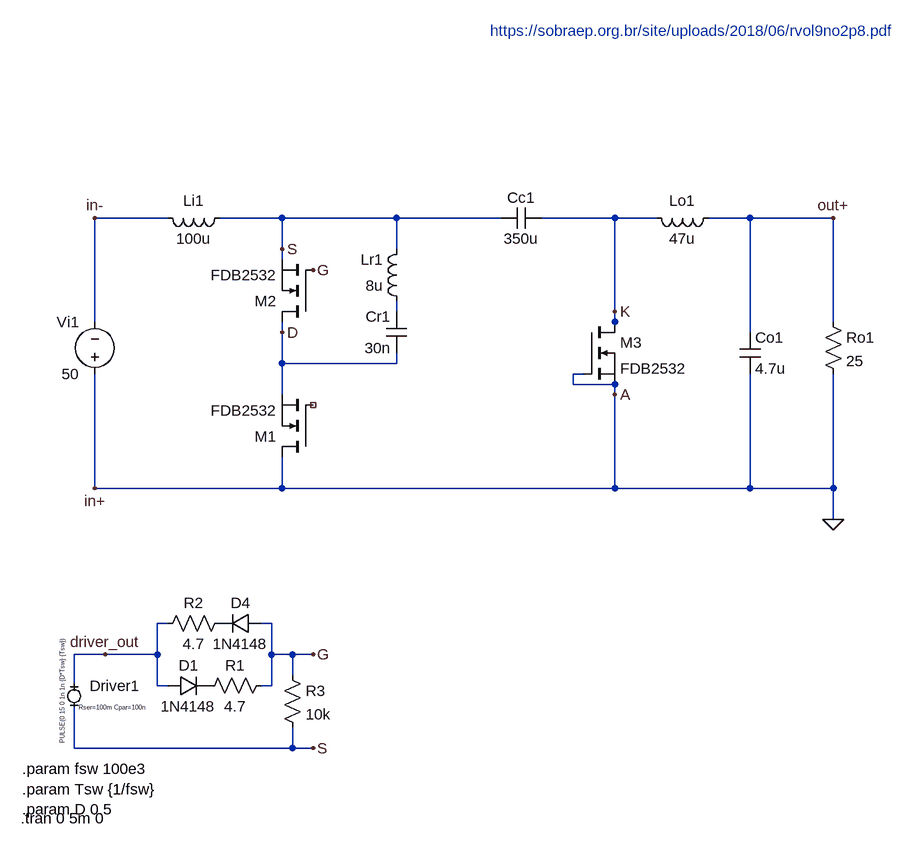
[diagram p0: schematic Draft2.asc]
Draft2.asc, the LTspice schematic file:
Version 4
SHEET 1 880 1004
WIRE -256 64 -368 64
WIRE -80 64 -176 64
WIRE 96 64 -80 64
WIRE 256 64 96 64
WIRE 432 64 320 64
WIRE 496 64 432 64
WIRE 640 64 576 64
WIRE 768 64 640 64
WIRE -80 112 -80 64
WIRE 96 112 96 64
WIRE -80 128 -80 112
WIRE 96 208 96 192
WIRE 432 208 432 64
WIRE -368 224 -368 64
WIRE 432 224 432 208
WIRE 768 224 768 64
WIRE -80 240 -80 224
WIRE 432 240 432 224
WIRE 640 240 640 64
WIRE -80 288 -80 240
WIRE 96 288 96 272
WIRE 96 288 -80 288
WIRE 384 304 368 304
WIRE 368 320 368 304
WIRE 432 320 432 304
WIRE 432 320 368 320
WIRE -80 336 -80 288
WIRE 432 336 432 320
WIRE -368 480 -368 304
WIRE -80 480 -80 432
WIRE -80 480 -368 480
WIRE 432 480 432 336
WIRE 432 480 -80 480
WIRE 640 480 640 304
WIRE 640 480 432 480
WIRE 768 480 768 304
WIRE 768 480 640 480
WIRE 768 528 768 480
WIRE -256 688 -272 688
WIRE -96 688 -112 688
WIRE -352 736 -400 736
WIRE -272 736 -272 688
WIRE -272 736 -352 736
WIRE -96 736 -96 688
WIRE -64 736 -96 736
WIRE -32 736 -64 736
WIRE -64 768 -64 736
WIRE -400 784 -400 736
WIRE -272 784 -272 736
WIRE -256 784 -272 784
WIRE -96 784 -96 736
WIRE -96 784 -112 784
WIRE -400 880 -400 816
WIRE -64 880 -64 848
WIRE -64 880 -400 880
WIRE -32 880 -64 880
FLAG 432 336 A
FLAG -32 144 G
FLAG 432 208 K
FLAG -80 112 S
FLAG -80 240 D
FLAG -32 736 G
FLAG -32 880 S
FLAG -352 736 driver_out
FLAG 768 528 0
FLAG 768 64 out+
FLAG -368 480 in+
FLAG -368 64 in-
SYMBOL voltage -368 320 R180
WINDOW 0 24 96 Left 2
WINDOW 3 24 16 Left 2
SYMATTR InstName Vi1
SYMATTR Value 50
SYMBOL ind -160 48 R90
WINDOW 0 5 56 VBottom 2
WINDOW 3 32 56 VTop 2
SYMATTR InstName Li1
SYMATTR Value 100u
SYMBOL ind 592 48 R90
WINDOW 0 5 56 VBottom 2
WINDOW 3 32 56 VTop 2
SYMATTR InstName Lo1
SYMATTR Value 47u
SYMBOL cap 112 272 R180
WINDOW 0 24 56 Left 2
WINDOW 3 24 8 Left 2
SYMATTR InstName Cr1
SYMATTR Value 30n
SYMBOL ind 112 208 R180
WINDOW 0 36 80 Left 2
WINDOW 3 36 40 Left 2
SYMATTR InstName Lr1
SYMATTR Value 8u
SYMBOL cap 320 48 R90
WINDOW 0 0 32 VBottom 2
WINDOW 3 32 32 VTop 2
SYMATTR InstName Cc1
SYMATTR Value 350u
SYMBOL cap 624 240 R0
SYMATTR InstName Co1
SYMATTR Value 4.7u
SYMBOL res 752 208 R0
SYMATTR InstName Ro1
SYMATTR Value 25
SYMBOL nmos -32 224 R180
SYMATTR InstName M2
SYMATTR Value FDB2532
SYMBOL nmos 384 224 R0
SYMATTR InstName M3
SYMATTR Value FDB2532
SYMBOL diode -256 800 R270
WINDOW 0 32 32 VTop 2
WINDOW 3 0 32 VBottom 2
SYMATTR InstName D1
SYMATTR Value 1N4148
SYMBOL diode -112 672 R90
WINDOW 0 0 32 VBottom 2
WINDOW 3 32 32 VTop 2
SYMATTR InstName D4
SYMATTR Value 1N4148
SYMBOL res -96 768 R90
WINDOW 0 0 56 VBottom 2
WINDOW 3 32 56 VTop 2
SYMATTR InstName R1
SYMATTR Value 4.7
SYMBOL res -160 672 R90
WINDOW 0 0 56 VBottom 2
WINDOW 3 32 56 VTop 2
SYMATTR InstName R2
SYMATTR Value 4.7
SYMBOL res -80 752 R0
SYMATTR InstName R3
SYMATTR Value 10k
SYMBOL MiniSyms4\\voltage- -400 800 R0
WINDOW 3 -18 -90 VRight 0
WINDOW 123 0 0 Left 0
WINDOW 39 7 17 Left 0
SYMATTR Value PULSE(0 15 0 1n 1n {D*Tsw} {Tsw})
SYMATTR SpiceLine Rser=100m Cpar=100n
SYMATTR InstName Driver1
SYMBOL nmos -32 432 R180
SYMATTR InstName M1
SYMATTR Value FDB2532
TEXT 240 -224 Left 2 ;https://sobraep.org.br/site/uploads/2018/06/rvol9no2p8.pdf
TEXT -480 912 Left 2 !.param fsw 100e3\n.param Tsw {1/fsw}\n.param D 0.5
TEXT -482 988 Left 2 !.tran 0 5m 0

The netlist it stands for:
* Draft2.asc
Vi1 0 in- 50
Li1 S in- 100u
Lo1 out+ K 47u
Cr1 D N001 30n
Lr1 N001 S 8u
Cc1 K S 350u
Co1 out+ 0 4.7u
Ro1 out+ 0 25
M2 D G S S FDB2532
M3 K 0 0 0 FDB2532
D1 driver_out P001 1N4148
D4 G P002 1N4148
R1 G P001 4.7
R2 P002 driver_out 4.7
R3 G S 10k
V§Driver1 driver_out S PULSE(0 15 0 1n 1n {D*Tsw} {Tsw}) Rser=100m Cpar=100n
M1 0 NC_01 D D FDB2532
.model D D
.lib standard.dio
.model NMOS NMOS
.model PMOS PMOS
.lib standard.mos
* https://sobraep.org.br/site/uploads/2018/06/rvol9no2p8.pdf
.param fsw 100e3
.param Tsw {1/fsw}
.param D 0.5
.tran 0 5m 0
.backanno
.end